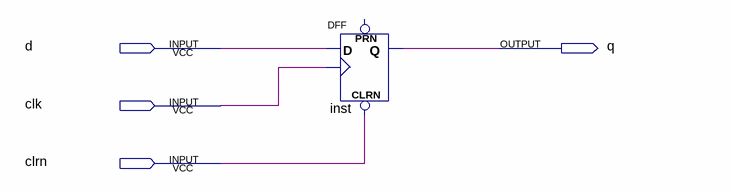
[diagram p0: schematic sheet]
// Quartus schematic dff2627.bdf as structural Verilog: 1 symbols, 4 pins
module dff2627 (
  input  d,
  input  clk,
  input  clrn,
  output q
);

  DFF inst (.CLRN(clrn), .CLK(clk), .D(d), .Q(q));  // open: PRN
endmodule
